# EAGLE design automation (EAGLE 9.7.0)
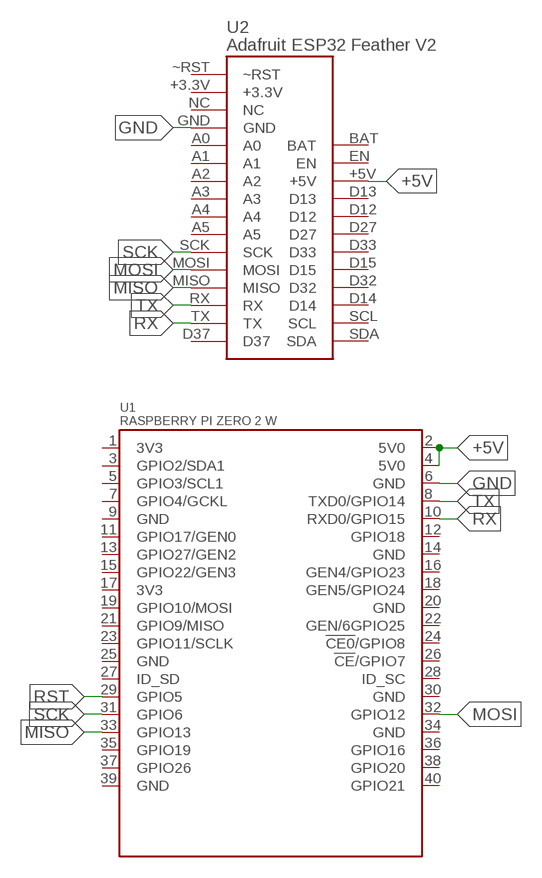
[diagram p0: schematic, sheet 1]

## Parts
U1  RASPBERRY PI ZERO 2 W  RPI-ZERO  [RASPBERRYPI_BASTELSTUBE_V13_RASPI_BOARD_B+_FULL]
U2  Adafruit ESP32 Feather V2  ESP32FEATHERV2ESP32FEATHERV2HEADERS  [ESP32FEATHERV2HEADERS]

## Nets
+5V: U1.2(5V0) U1.4(5V0) U2.+5V
GND: U1.6(GND) U2.GND
MISO: U1.33(GPIO13) U2.MISO
MOSI: U1.32(GPIO12) U2.MOSI
RST: U1.29(GPIO5)
RX: U1.10(RXD0/GPIO15) U2.TX
SCK: U1.31(GPIO6) U2.SCK
TX: U1.8(TXD0/GPIO14) U2.RX
Unconnected: U1.1(3V3) U1.3(GPIO2/SDA1) U1.5(GPIO3/SCL1) U1.7(GPIO4/GCKL) U1.9(GND) U1.11(GPIO17/GEN0) U1.12(GPIO18) U1.13(GPIO27/GEN2) U1.14(GND) U1.15(GPIO22/GEN3) U1.16(GEN4/GPIO23) U1.17(3V3) U1.18(GEN5/GPIO24) U1.19(GPIO10/MOSI) U1.20(GND) U1.21(GPIO9/MISO) U1.22(GEN/6GPIO25) U1.23(GPIO11/SCLK) U1.24(!CE0!/GPIO8) U1.25(GND) U1.26(!CE!/GPIO7) U1.27(ID_SD) U1.28(ID_SC) U1.30(GND) U1.34(GND) U1.35(GPIO19) U1.36(GPIO16) U1.37(GPIO26) U1.38(GPIO20) U1.39(GND) U1.40(GPIO21) U2.+3.3V U2.A0 U2.A1 U2.A2 U2.A3 U2.A4 U2.A5 U2.BAT U2.D12 U2.D13 U2.D14 U2.D15 U2.D27 U2.D32 U2.D33 U2.D37 U2.EN U2.NC U2.SCL U2.SDA U2.~RST

## Library data of the parts
U1 = Raspberry Pi Zero 2 W:RPI-ZERO
U2 = ESP32 Feather V2 Socket:ESP32FEATHERV2

## Board
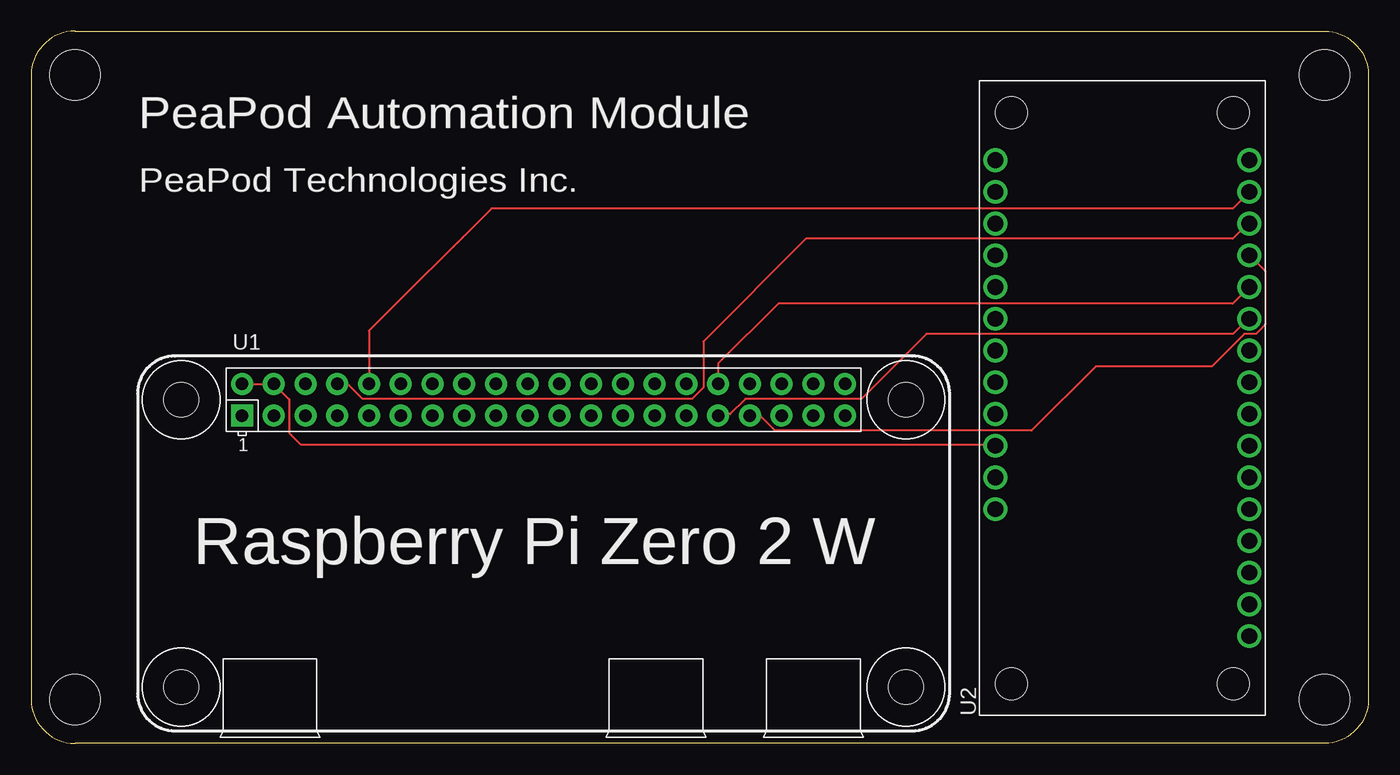
[diagram p1: board, top side]
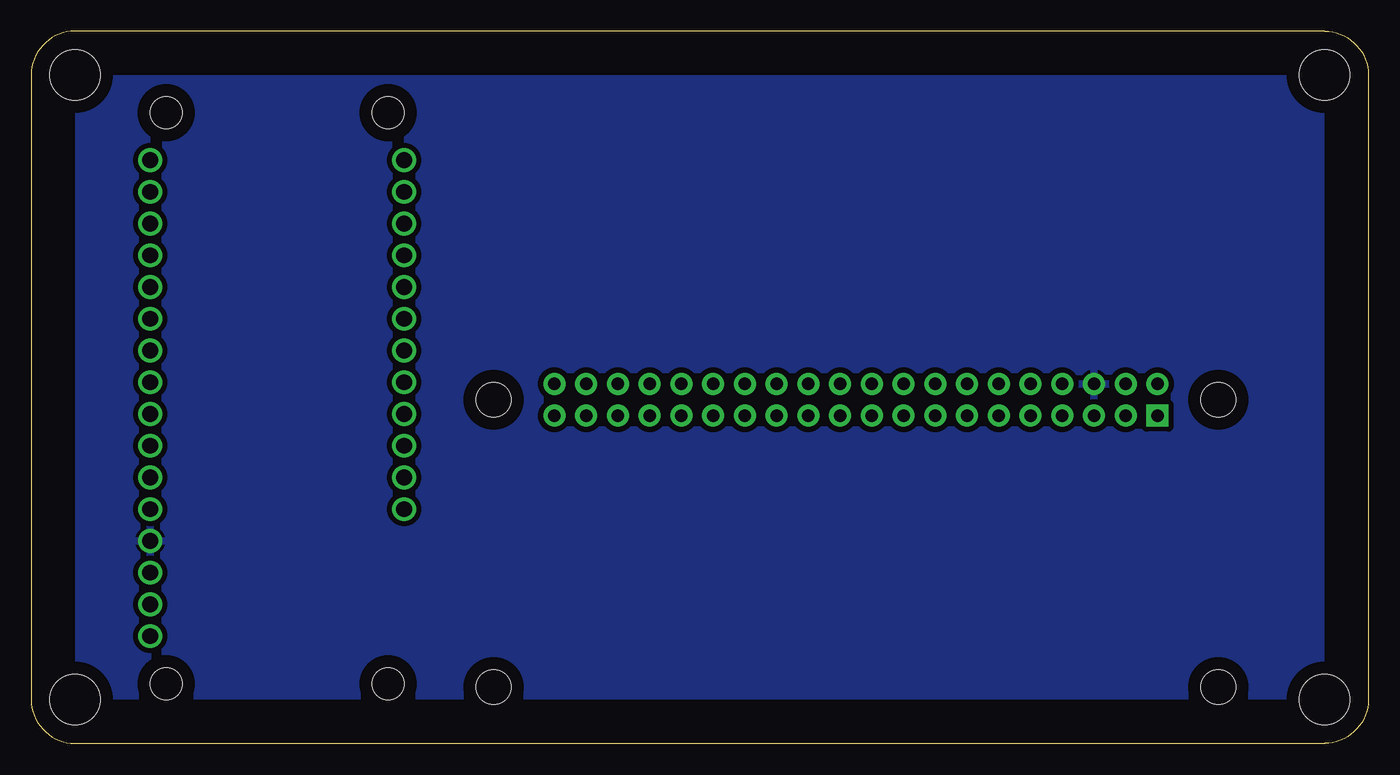
[diagram p2: board, bottom side, seen from below]

Size 107 x 57 mm. Coordinates in mm from the lower left corner, seen from the top.
Outline: 107,53.5 107,3.5 arc-90 103.5,0 3.5,0 arc-90 0,3.5 0,53.5 arc-90 3.5,57 103.5,57 arc-90 107,53.5
Copper layers (1*16): Top 0.035mm / dielectric 1.5mm / Bottom 0.035mm
Design rules "Fusion Electronics Design Rules": minimum track width 6mil, minimum drill 0.35mm, track to track 6mil, track to pad 6mil, pad to pad 6mil, via to via 6mil, smd to smd 6mil, copper to edge 40mil, drill to drill 6mil, minimum pad ring 10mil, minimum via ring 8mil, stop-mask expansion 4mil, vias tented up to drill 0mil, thermal gap 10mil
Holes 4 mm at 3.5,3.5 3.5,53.5 103.5,53.5 103.5,3.5

### Footprints (pad centres in the part's own frame; a part is rotated, then mirrored left to right if it is on the bottom)
RASPBERRYPI_BASTELSTUBE_V13_RASPI_BOARD_B+_FULL = drill 1 pad 1.778 square: 1 8.37,25.23 | drill 1 pad 1.778: 2 8.37,27.77; 3 10.91,25.23; 4 10.91,27.77; 5 13.45,25.23; 6 13.45,27.77; 7 15.99,25.23; 8 15.99,27.77; 9 18.53,25.23; 10 18.53,27.77; 11 21.07,25.23; 12 21.07,27.77; 13 23.61,25.23; 14 23.61,27.77; 15 26.15,25.23; 16 26.15,27.77; 17 28.69,25.23; 18 28.69,27.77; 19 31.23,25.23; 20 31.23,27.77; 21 33.77,25.23; 22 33.77,27.77; 23 36.31,25.23; 24 36.31,27.77; 25 38.85,25.23; 26 38.85,27.77; 27 41.39,25.23; 28 41.39,27.77; 29 43.93,25.23; 30 43.93,27.77; 31 46.47,25.23; 32 46.47,27.77; 33 49.01,25.23; 34 49.01,27.77; 35 51.55,25.23; 36 51.55,27.77; 37 54.09,25.23; 38 54.09,27.77; 39 56.63,25.23; 40 56.63,27.77 | hole 2.75: 3.5,3.5; 3.5,26.5; 61.5,3.5; 61.5,26.5
ESP32FEATHERV2HEADERS = drill 1.27: +3.3V -35.56,0; +5V -22.86,20.32; A0 -27.94,0; A1 -25.4,0; A2 -22.86,0; A3 -20.32,0; A4 -17.78,0; A5 -15.24,0; BAT -27.94,20.32; D12 -17.78,20.32; D13 -20.32,20.32; D14 -5.08,20.32; D15 -10.16,20.32; D27 -15.24,20.32; D32 -7.62,20.32; D33 -12.7,20.32; D37 0,0; EN -25.4,20.32; GND -30.48,0; MISO -7.62,0; MOSI -10.16,0; NC -33.02,0; RX -5.08,0; SCK -12.7,0; SCL -2.54,20.32; SDA 0,20.32; TX -2.54,0; ~RST -38.1,0 | hole 2.54: 3.81,19.05; 3.81,1.27; -41.91,1.27; -41.91,19.05

### Placement (x,y rotation side)
U1  8.5,1 0 top
U2  97.48,46.68 90 top

### Tracks (layer width: path | path; a pad name or v marks a point on that pad's centre or on a via)
+5V
  Top 0.152: U2.+5V 77.11,23.92 21.56,23.92 20.64,24.84 20.64,27.54 U1.4 U1.2
GND
  pour Bottom (isolate 0.406): 3.8,3.8 103.2,3.8 103.2,53.2 3.8,53.2
MISO
  Top 0.152: U2.MISO 98.75,37.79 98.75,33.52 97.99,32.76 97.07,32.76 94.48,30.17 85.18,30.17 80.04,25.03 59.54,25.03 58.36,26.21 57.6,26.21 U1.33
MOSI
  Top 0.152: U1.32 54.97,30.38 59.79,35.2 96.16,35.2 U2.MOSI
RX
  Top 0.152: U1.10 27.03,33.02 36.83,42.82 96.16,42.82 U2.TX
SCK
  Top 0.152: U1.31 55.01,26.36 55.93,26.36 57.15,27.58 66.44,27.58 71.62,32.76 96.16,32.76 97.38,33.98 U2.SCK
TX
  Top 0.152: U1.8 24.53,28.65 25.45,28.65 26.51,27.58 52.88,27.58 53.79,28.49 53.79,32.18 62,40.38 96.16,40.38 97.38,41.6 U2.RX

### Text on the board
tPlace: PeaPod Automation Module | PeaPod Technologies Inc.